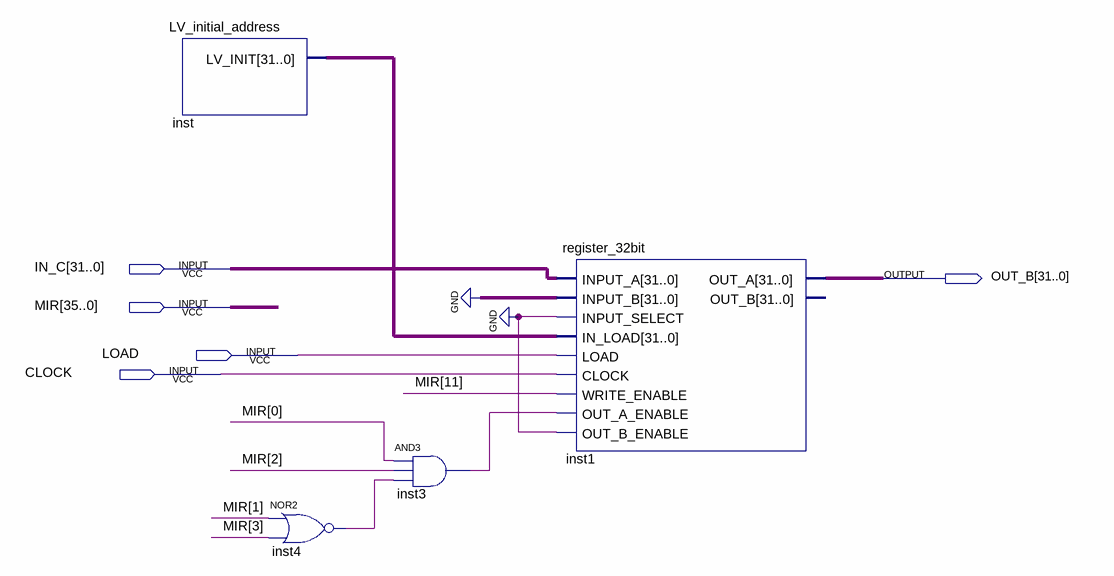
[diagram p0: schematic sheet]
// Quartus schematic LV.bdf as structural Verilog: 4 symbols, 5 pins
module LV (
  input  [31:0] IN_C,
  input  [35:0] MIR,
  input  LOAD,
  input  CLOCK,
  output [31:0] OUT_B
);

  wire inst3_out, inst4_out;
  wire [31:0] inst_lv_init;

  LV_initial_address inst (.LV_INIT(inst_lv_init));
  nor inst4 (inst4_out, MIR[1], MIR[3]);
  and inst3 (inst3_out, MIR[0], MIR[2], inst4_out);
  register_32bit inst1 (
    .INPUT_A(IN_C), .INPUT_B({32{1'b0}}), .INPUT_SELECT(1'b0), .IN_LOAD(inst_lv_init), .LOAD(LOAD),
    .CLOCK(CLOCK), .WRITE_ENABLE(MIR[11]), .OUT_A_ENABLE(inst3_out), .OUT_B_ENABLE(1'b0), .OUT_A(OUT_B));  // open: OUT_B
endmodule
